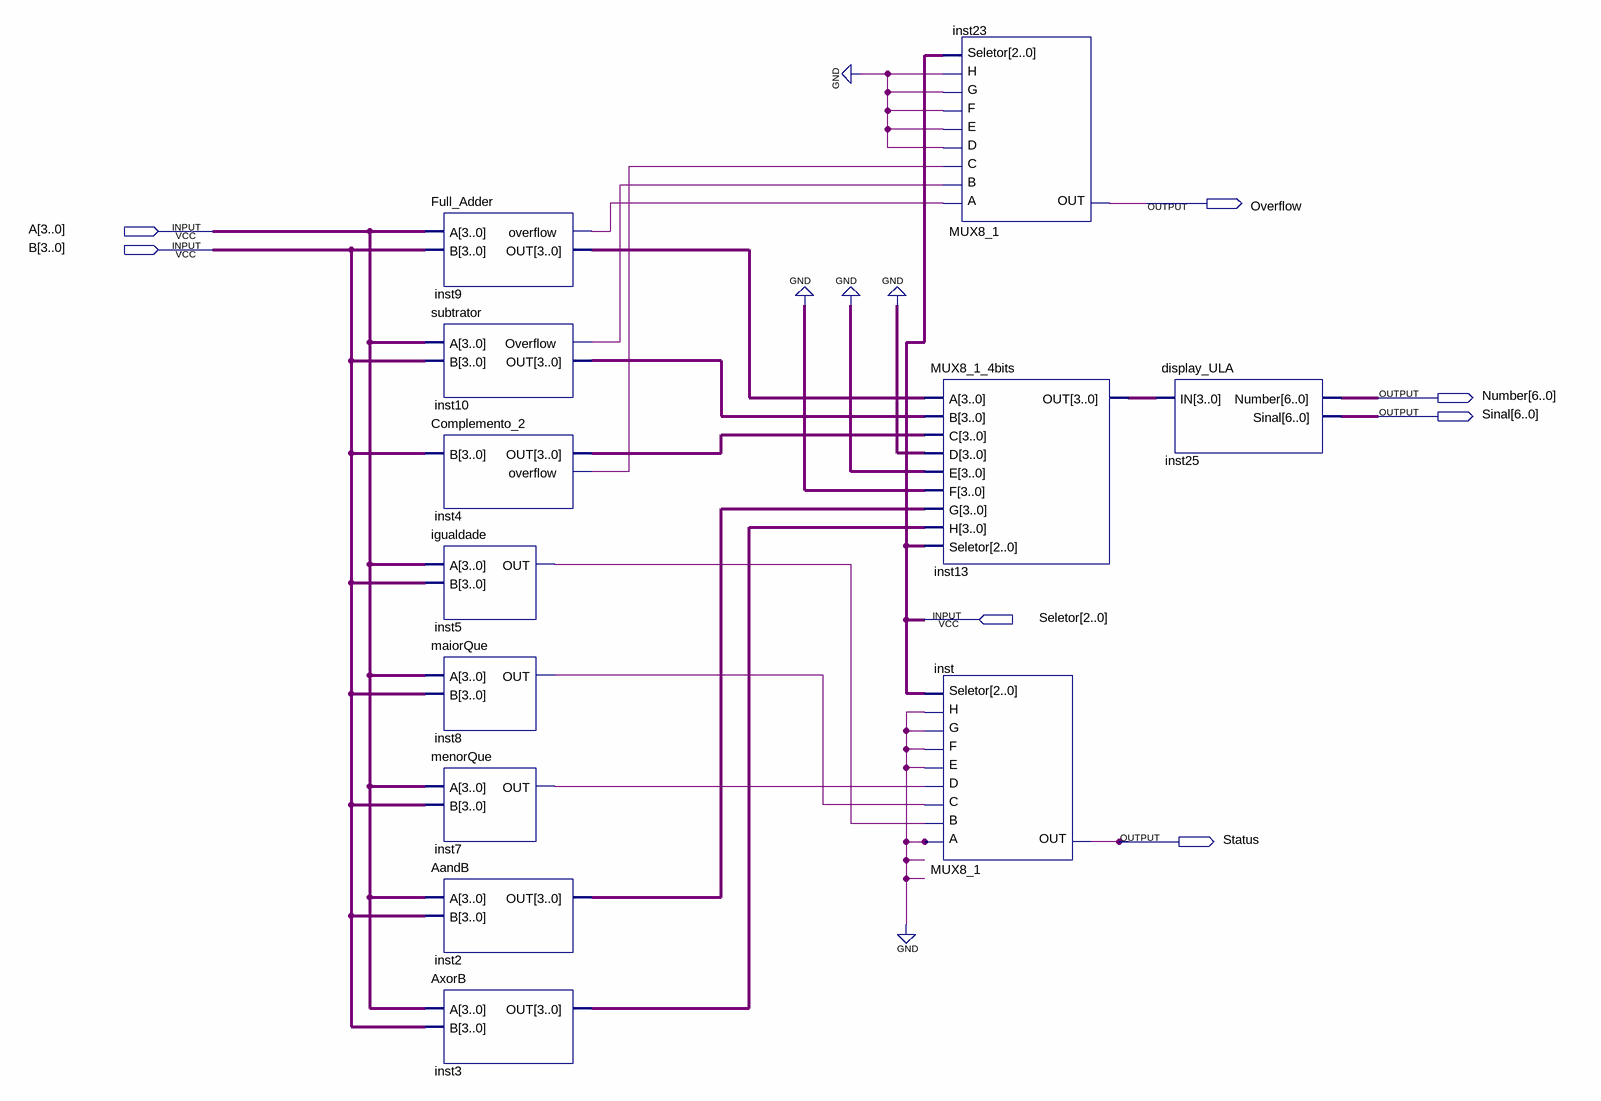
[diagram p0: schematic sheet]
// Quartus schematic ULA.bdf as structural Verilog: 12 symbols, 7 pins
module ULA (
  input  [3:0] A,
  input  [3:0] B,
  input  [2:0] Seletor,
  output Overflow,
  output [6:0] Number,
  output [6:0] Sinal,
  output Status
);

  wire inst4_overflow, inst5_out, inst7_out, inst8_out, inst9_overflow, inst10_overflow;
  wire [3:0] inst2_out, inst3_out, inst4_out, inst9_out, inst10_out, inst13_out;

  Full_Adder inst9 (.A(A), .B(B), .overflow(inst9_overflow), .OUT(inst9_out));
  subtrator inst10 (.A(A), .B(B), .Overflow(inst10_overflow), .OUT(inst10_out));
  Complemento_2 inst4 (.B(B), .OUT(inst4_out), .overflow(inst4_overflow));
  igualdade inst5 (.A(A), .B(B), .OUT(inst5_out));
  maiorQue inst8 (.A(A), .B(B), .OUT(inst8_out));
  menorQue inst7 (.A(A), .B(B), .OUT(inst7_out));
  AandB inst2 (.A(A), .B(B), .OUT(inst2_out));
  AxorB inst3 (.A(A), .B(B), .OUT(inst3_out));
  MUX8_1 inst23 (
    .A(inst9_overflow), .B(inst10_overflow), .C(inst4_overflow), .D(1'b0), .E(1'b0), .F(1'b0), .G(1'b0),
    .H(1'b0), .Seletor(Seletor), .OUT(Overflow));
  MUX8_1_4bits inst13 (
    .A(inst9_out), .B(inst10_out), .C(inst4_out), .D(4'b0000), .E(4'b0000), .F(4'b0000), .G(inst2_out),
    .H(inst3_out), .Seletor(Seletor), .OUT(inst13_out));
  MUX8_1 inst (
    .A(1'b0), .B(inst5_out), .C(inst8_out), .D(inst7_out), .E(1'b0), .F(1'b0), .G(1'b0), .H(1'b0),
    .Seletor(Seletor), .OUT(Status));
  display_ULA inst25 (.IN(inst13_out), .Number(Number), .Sinal(Sinal));
endmodule
